# EAGLE design 1591XXA-RS485 to Neopixel with RJ45 (EAGLE 9.4.2)
RS485 over Ethernet to NeoPixel for Hammond 1591XXA enclosures
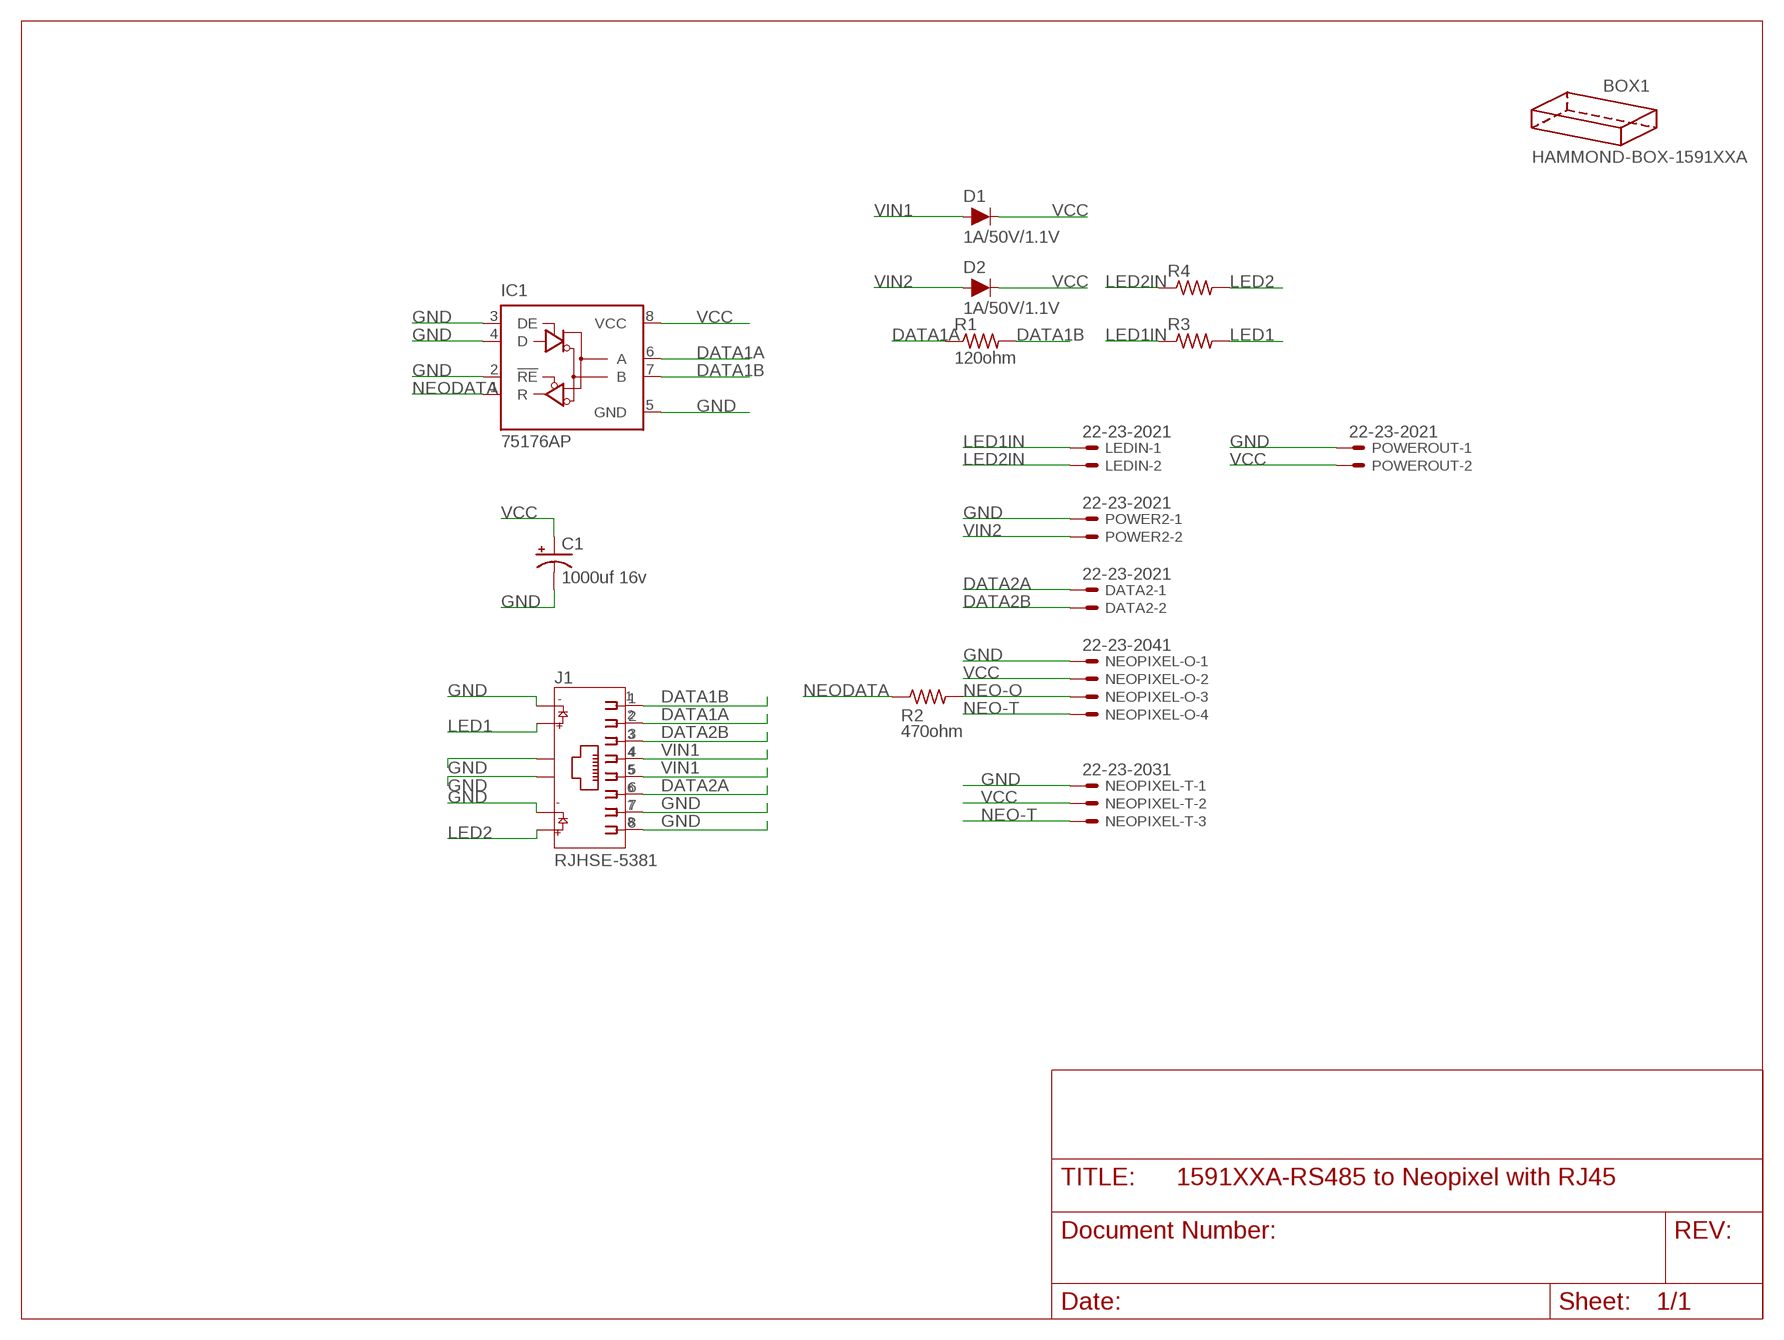
[diagram p0: schematic, sheet 1]

## Parts
BOX1  HAMMOND-BOX-1591XXA  [1591XXA]
C1  1000uf 16v  1000UF-RADIAL-5MM-25V-20%  [CPOL-RADIAL-5MM-10MM]
D1  1A/50V/1.1V  DIODE-PTH  [DIODE-1N4001]
D2  1A/50V/1.1V  DIODE-PTH  [DIODE-1N4001]
DATA2  22-23-2021  [22-23-2021]
IC1  75176AP  [DIL08]
J1  RJHSE-5381  [AMPHENOL_RJHSE-5381]
LEDIN  22-23-2021  [22-23-2021]
NEOPIXEL-O  22-23-2041  [22-23-2041]
NEOPIXEL-T  22-23-2031  [22-23-2031]
POWER2  22-23-2021  [22-23-2021]
POWEROUT  22-23-2021  [22-23-2021]
R1  120ohm  R-US_0207/10  [0207/10]
R2  470ohm  R-US_0207/10  [0207/10]
R3  R-US_0207/10  [0207/10]
R4  R-US_0207/10  [0207/10]

## Nets
DATA1A: IC1.6(A) J1.2 R1.1
DATA1B: IC1.7(B) J1.1 R1.2
DATA2A: DATA2.1 J1.6
DATA2B: DATA2.2 J1.3
GND: C1.- IC1.2(!RE) IC1.3(DE) IC1.4(D) IC1.5(GND) J1.7 J1.8 J1.9 J1.11 J1.S1 J1.S2 NEOPIXEL-O.1 NEOPIXEL-T.1 POWER2.1 POWEROUT.1
LED1: J1.10 R3.2
LED1IN: LEDIN.1 R3.1
LED2: J1.12 R4.2
LED2IN: LEDIN.2 R4.1
NEO-O: NEOPIXEL-O.3 R2.2
NEO-T: NEOPIXEL-O.4 NEOPIXEL-T.3
NEODATA: IC1.1(R) R2.1
VCC: C1.+ D1.C D2.C IC1.8(VCC) NEOPIXEL-O.2 NEOPIXEL-T.2 POWEROUT.2
VIN1: D1.A J1.4 J1.5
VIN2: D2.A POWER2.2

## Library data of the parts
BOX1 = hammond:HAMMOND-BOX: Hammond Project boxes Hammond 1551 Transluscent Blue 50x35x20mm 1551GTBU http://www.hammondmfg.com/pdf/1551G.pdf Hammond 1551 Transluscent Blue 50x50x20mm 1551RTBU http://www.hammondmfg.com/pdf/1551R.pdf Hammond 1551 Transluscent Blue 60x35x20mm 1551HTBU http://www.hammondmfg.com/pdf/1551H.pdf Hammond 1551 Transluscent Blue 80x40x20mm 1551KTBU http://www.hammondmfg.com/pdf/1551K.pdf Hammond 1591 Transluscent Blue 100x51x22mm 1591XXATBU http://www.hammondmfg.com/pdf/1591XXA.pdf Hammond 1553B 117x79x24mm 1553B__BK http://www.hammondmfg.com/pdf/1553B.pdf Hammond 1553D 147x78x24mm 1553B__BK http://www.hammondmfg.com/pdf/1553C.pdf
C1 = SparkFun-Capacitors:1000UF: 1,000µF/1mF ceramic capacitors A capacitor is a passive two-terminal electrical component used to store electrical energy temporarily in an electric field. CAP-08070; PROD_ID: CAP-09538; VALUE: 1mF
D1 D2 = SparkFun-DiscreteSemi:DIODE: Diode These are standard reverse protection diodes and small signal diodes. SparkFun Products: SparkFun SparkPunk Sound Kit <https://www.sparkfun.com/products/11177> SparkFun ESP8266 Thing <https://www.sparkfun.com/products/13231>; PROD_ID: DIO-09176
DATA2 LEDIN POWER2 POWEROUT = con-molex:22-23-2021: .100" (2.54mm) Center Header - 2 Pin; MF: MOLEX; MPN: 22-23-2021; OC_FARNELL: 1462926; OC_NEWARK: 25C3832
IC1 = 751xx:75176A: DIFFERENTIAL BUS TRANSCEIVER Source: http://focus.ti.com/lit/ds/symlink/sn75176a.pdf
J1 = RJHSE-5381:RJHSE-5381: connector, mod jack, rt angle pcb, shielded, led1-g, led2-y, single port, rj-45 8 cont; AVAILABILITY: Unavailable; DESCRIPTION: connector, mod jack, rt angle pcb, shielded, led1-g, led2-y, single port, rj-45 8 cont; MF: Amphenol ICC; MP: RJHSE-5381; PACKAGE: None; PRICE: None
NEOPIXEL-O = con-molex:22-23-2041: .100" (2.54mm) Center Header - 4 Pin; MF: MOLEX; MPN: 22-23-2041; OC_FARNELL: 1462920; OC_NEWARK: 38C0355
NEOPIXEL-T = con-molex:22-23-2031: .100" (2.54mm) Center Header - 3 Pin; MF: MOLEX; MPN: 22-23-2031; OC_FARNELL: 1462950; OC_NEWARK: 30C0862
R1-R4 = rcl:R-US_: RESISTOR, American symbol; SPICEPREFIX: R

## Board
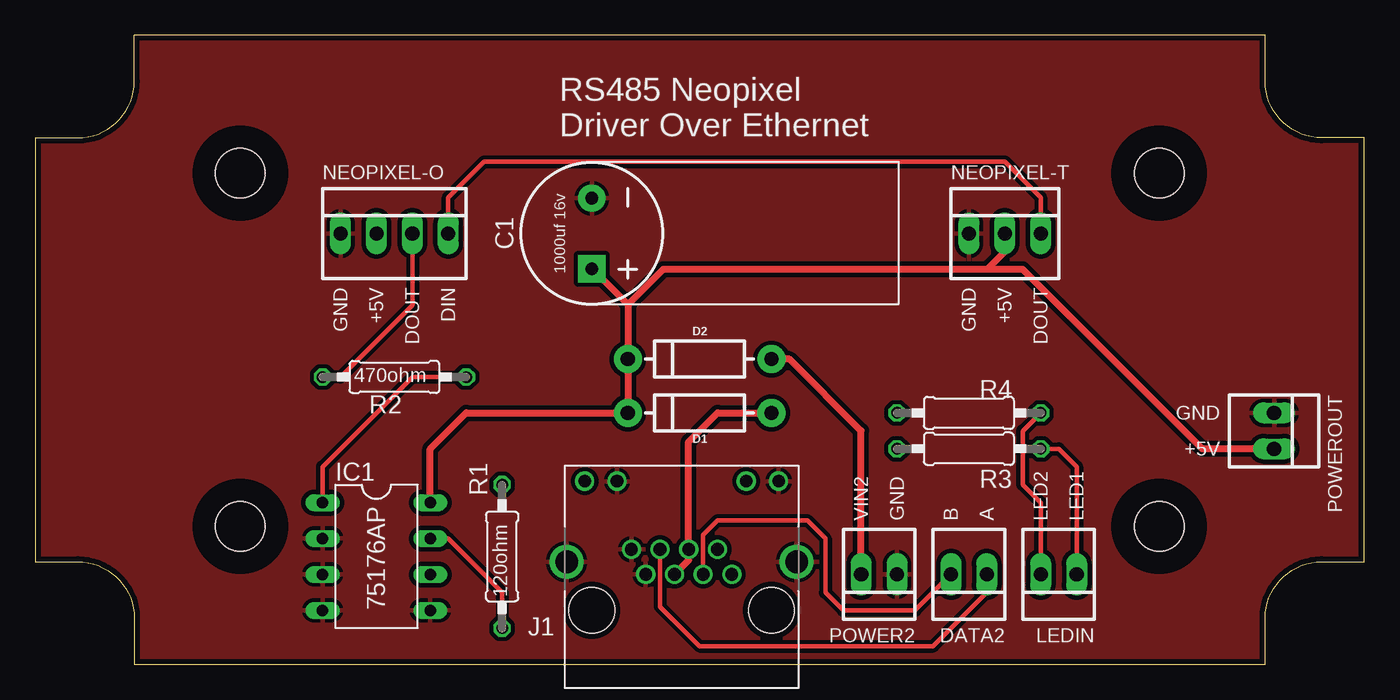
[diagram p1: board, top side]
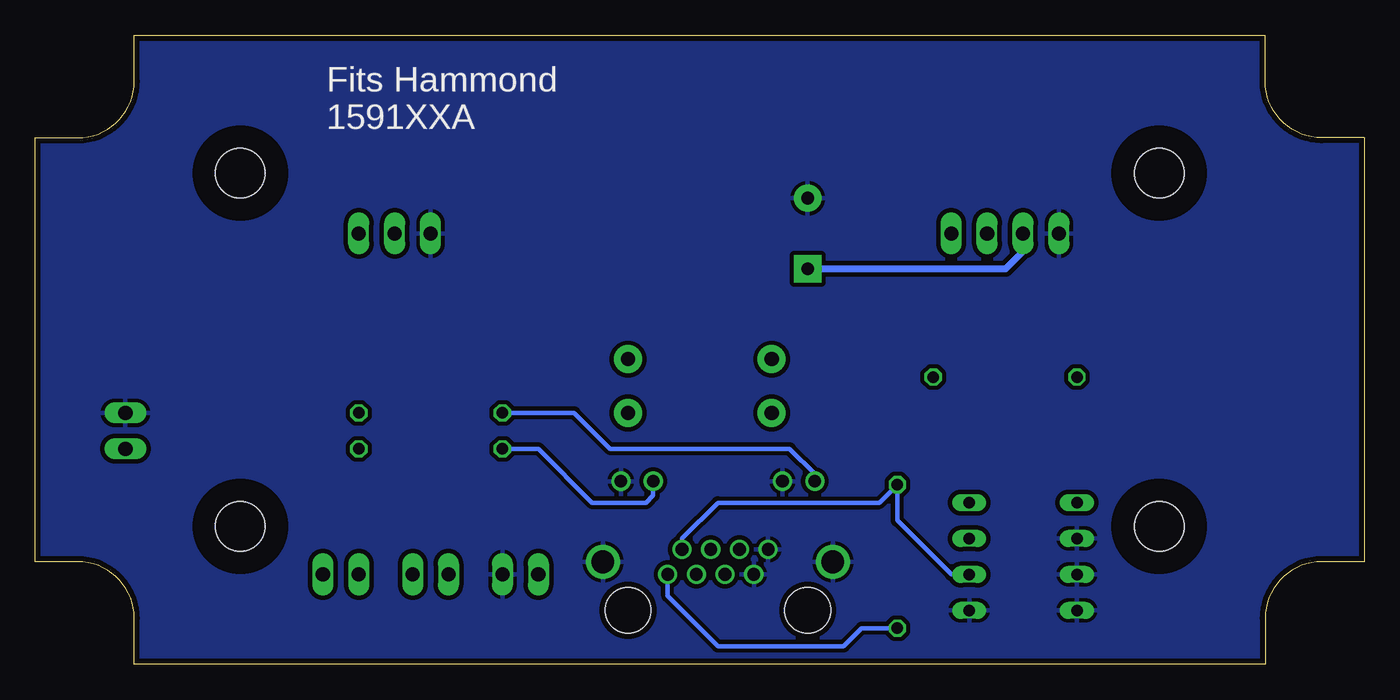
[diagram p2: board, bottom side, seen from below]

Size 94 x 44.5 mm. Coordinates in mm from the lower left corner, seen from the top.
Copper layers (1*16): Top 0.035559375mm / dielectric 1.6mm / Bottom 0.035559375mm
Design rules "oshpark-2layer": minimum track width 6mil, minimum drill 10mil, track to track 6mil, track to pad 6mil, pad to pad 6mil, via to via 6mil, smd to smd 6mil, copper to edge 15mil, drill to drill 6mil, minimum pad ring 5mil, minimum via ring 5mil, stop-mask expansion 2.5mil, vias tented up to drill 0mil, thermal gap 10mil

### Footprints (pad centres in the part's own frame; a part is rotated, then mirrored left to right if it is on the bottom)
1591XXA = hole 3.5: 79.5,9.75; 14.5,34.75; 79.5,34.75; 14.5,9.75
CPOL-RADIAL-5MM-10MM = drill 0.9 pad 1.93 square: + 2.5,0 | drill 0.9 pad 1.93: - -2.5,0
DIODE-1N4001 = drill 1 pad 1.981: A -5.08,0; C 5.08,0
22-23-2021 = drill 1 long: 1 -1.27,0; 2 1.27,0
DIL08 = drill 0.813 long: 1 -3.81,-3.81; 2 -1.27,-3.81; 3 1.27,-3.81; 4 3.81,-3.81; 5 3.81,3.81; 6 1.27,3.81; 7 -1.27,3.81; 8 -3.81,3.81
AMPHENOL_RJHSE-5381 = drill 0.9: 1 3.55,2.54; 2 2.53,4.32; 3 1.52,2.54; 4 0.5,4.32; 5 -0.51,2.54; 6 -1.53,4.32; 7 -2.54,2.54; 8 -3.56,4.32; 9 6.86,9.14; 10 4.57,9.14; 11 -4.57,9.14; 12 -6.86,9.14 | drill 1.6: S1 8.13,3.43; S2 -8.13,3.43 | hole 3.25: 6.35,0; -6.35,0
22-23-2041 = drill 1 long: 1 -3.81,0; 2 -1.27,0; 3 1.27,0; 4 3.81,0
22-23-2031 = drill 1 long: 1 -2.54,0; 2 0,0; 3 2.54,0
0207/10 = drill 0.813 octagon: 1 -5.08,0; 2 5.08,0

### Placement (x,y rotation side)
BOX1  0,0 0 top
C1  39.37,30.48 270 top
D1  46.99,17.78 180 top
D2  46.99,21.59 180 top
DATA2  66.04,6.35 180 top
IC1  24.13,7.62 270 top
J1  45.72,3.81 0 top
LEDIN  72.39,6.35 180 top
NEOPIXEL-O  25.4,30.48 0 top
NEOPIXEL-T  68.58,30.48 0 top
POWER2  59.69,6.35 180 top
POWEROUT  87.63,16.51 270 top
R1  33.02,7.62 270 top
R2  25.4,20.32 180 top
R3  66.04,15.24 180 top
R4  66.04,17.78 180 top

### Tracks (layer width: path | path; a pad name or v marks a point on that pad's centre or on a via)
DATA1A
  Bottom 0.305: J1.2 48.25,8.88 48.26,8.89 45.72,11.43 34.29,11.43 R1.1 33.02,10.16 29.21,6.35 IC1.6
DATA1B
  Top 0.305: IC1.7 29.21,8.89 33.02,5.08 R1.2
  Bottom 0.305: R1.2 35.56,2.54 36.83,1.27 45.72,1.27 49.27,4.82 J1.1
DATA2A
  Top 0.305: J1.6 44.19,4.07 46.99,1.27 63.5,1.27 67.31,5.08 DATA2.1
DATA2B
  Top 0.305: J1.3 47.24,9.14 48.26,10.16 54.61,10.16 55.88,8.89 55.88,5.08 57.15,3.81 62.23,3.81 DATA2.2
GND
  pour Top (isolate 0.305): 0,44.45 93.98,44.45 93.98,0 0,0
  pour Bottom (isolate 0.305): 0,44.45 93.98,44.45 93.98,6.35 96.52,3.81 96.52,0 0,0
LED1
  Bottom 0.305: J1.10 50.29,11.94 50.8,11.43 54.61,11.43 58.42,15.24 R3.2
LED1IN
  Top 0.305: R3.1 72.39,15.24 73.66,13.97 LEDIN.1
LED2
  Bottom 0.305: J1.12 38.86,13.46 40.64,15.24 53.34,15.24 55.88,17.78 R4.2
LED2IN
  Top 0.305: LEDIN.2 71.12,11.43 69.85,12.7 69.85,16.51 R4.1
NEO-O
  Top 0.305: NEOPIXEL-O.3 26.67,25.4 21.59,20.32 R2.2
NEO-T
  Top 0.305: NEOPIXEL-T.3 71.12,33.02 68.58,35.56 31.75,35.56 29.21,33.02 NEOPIXEL-O.4
NEODATA
  Top 0.305: IC1.1 20.32,13.97 26.67,20.32 R2.1
VCC
  Top 0.508: C1.+ 41.91,25.44 | 41.91,25.44 D2.C D1.C 30.48,17.78 27.94,15.24 IC1.8 | NEOPIXEL-T.2 68.58,29.21 67.31,27.94 | 41.91,25.44 44.41,27.94 66.04,27.94 67.31,27.94 | 67.31,27.94 69.85,27.94 82.55,15.24 POWEROUT.2
  Bottom 0.508: C1.+ 25.36,27.98 24.13,29.21 NEOPIXEL-O.2
VIN1
  Top 0.508: J1.5 46.22,7.36 J1.4 46.22,15.74 48.26,17.78 D1.A
VIN2
  Top 0.508: POWER2.2 58.42,16.51 53.34,21.59 D2.A

### Text on the board
tNames: RS485 Neopixel / Driver Over Ethernet | GND | +5V | DOUT | DIN | GND | +5V | DOUT | GND | +5V | VIN2 | GND | B | A | LED2 | LED1
bNames: Fits Hammond / 1591XXA